# EasyEDA Pro project ProPrj_JS203-39-FIBER-3_2024-11-07.epro, board PCB1
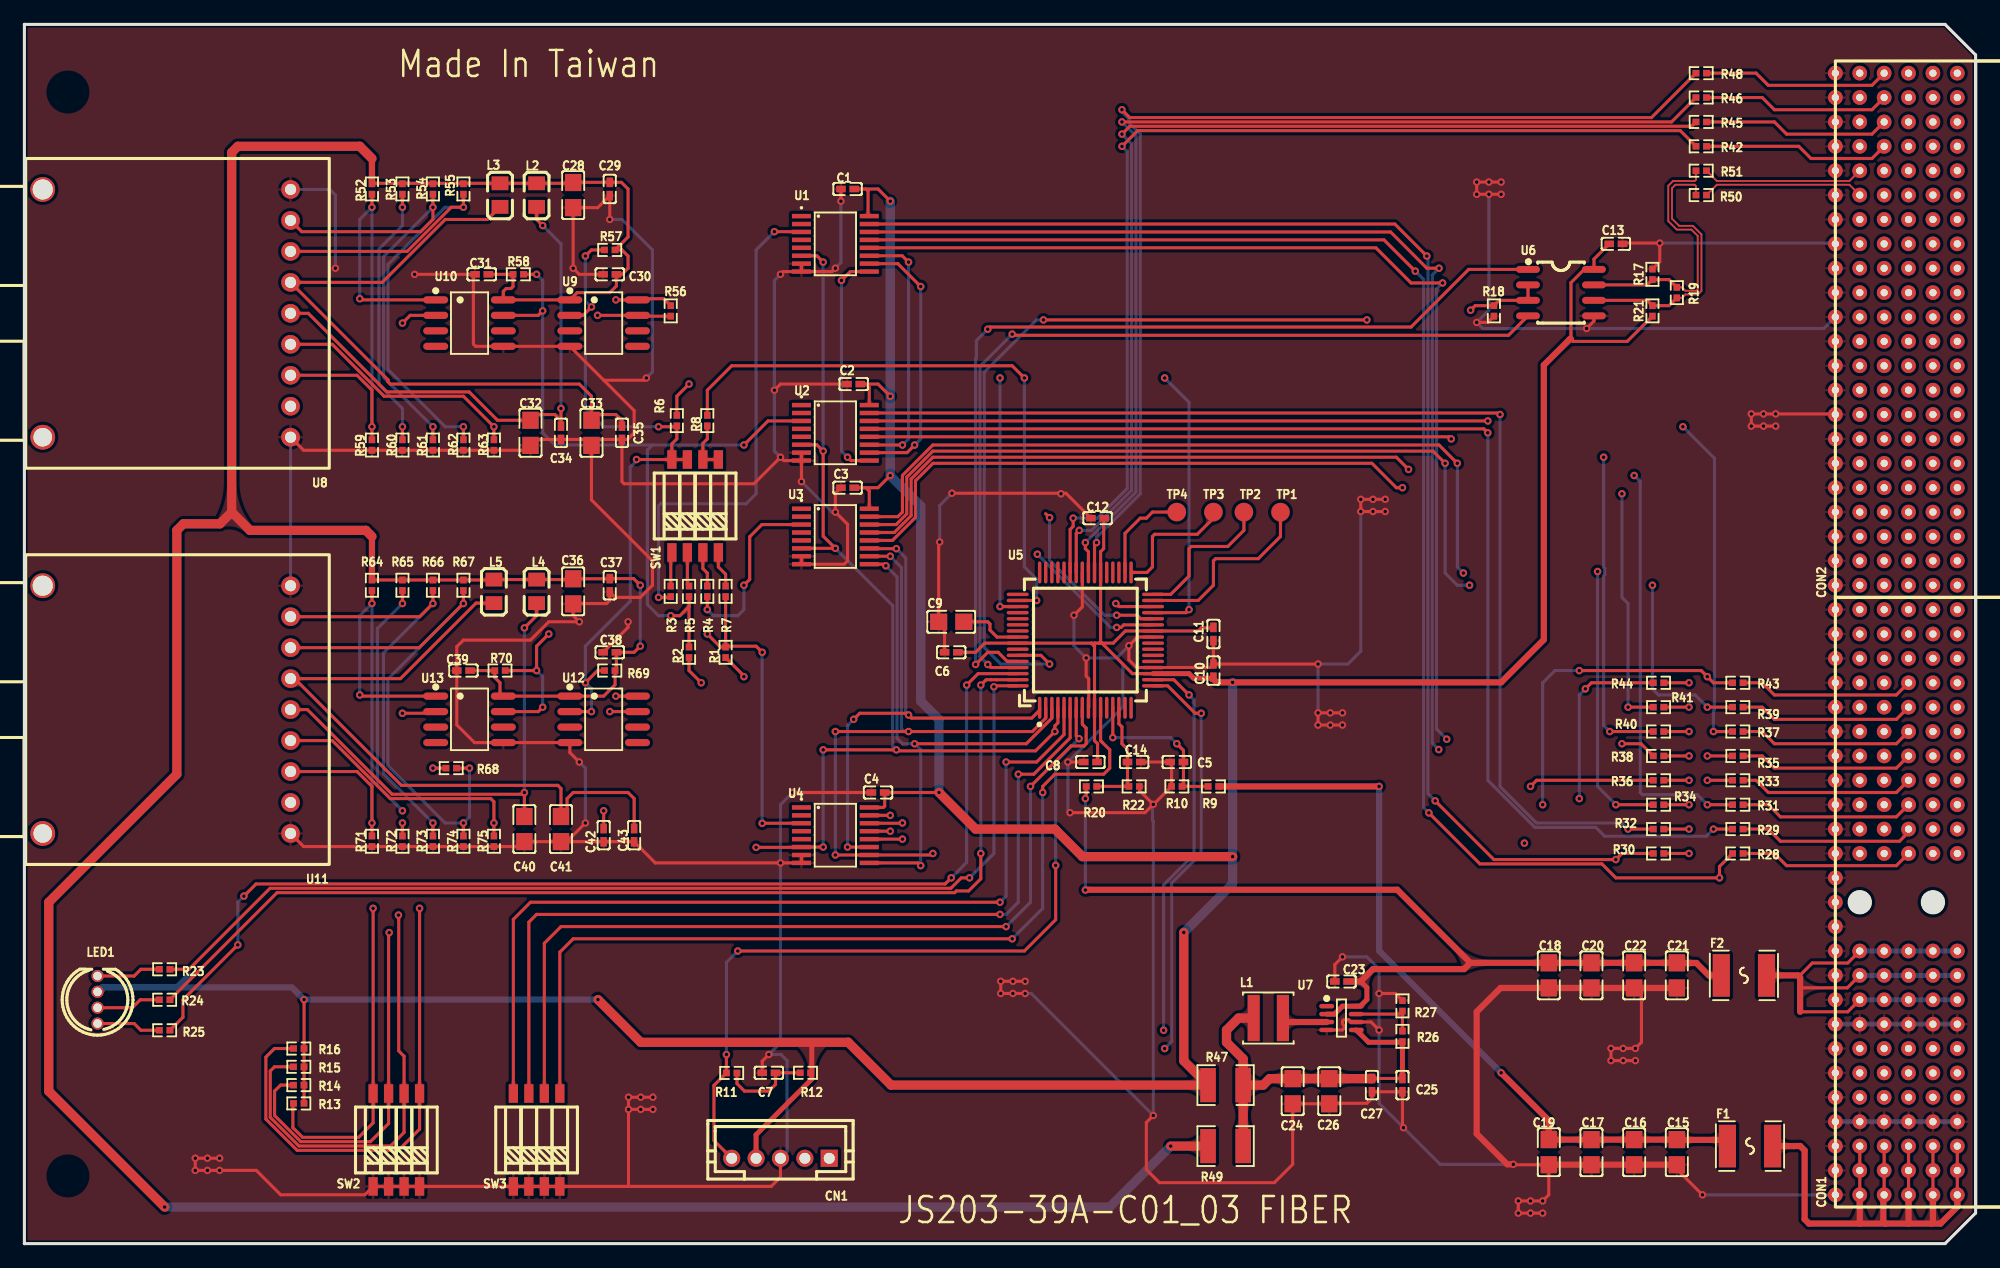
[diagram p4: board, top side]
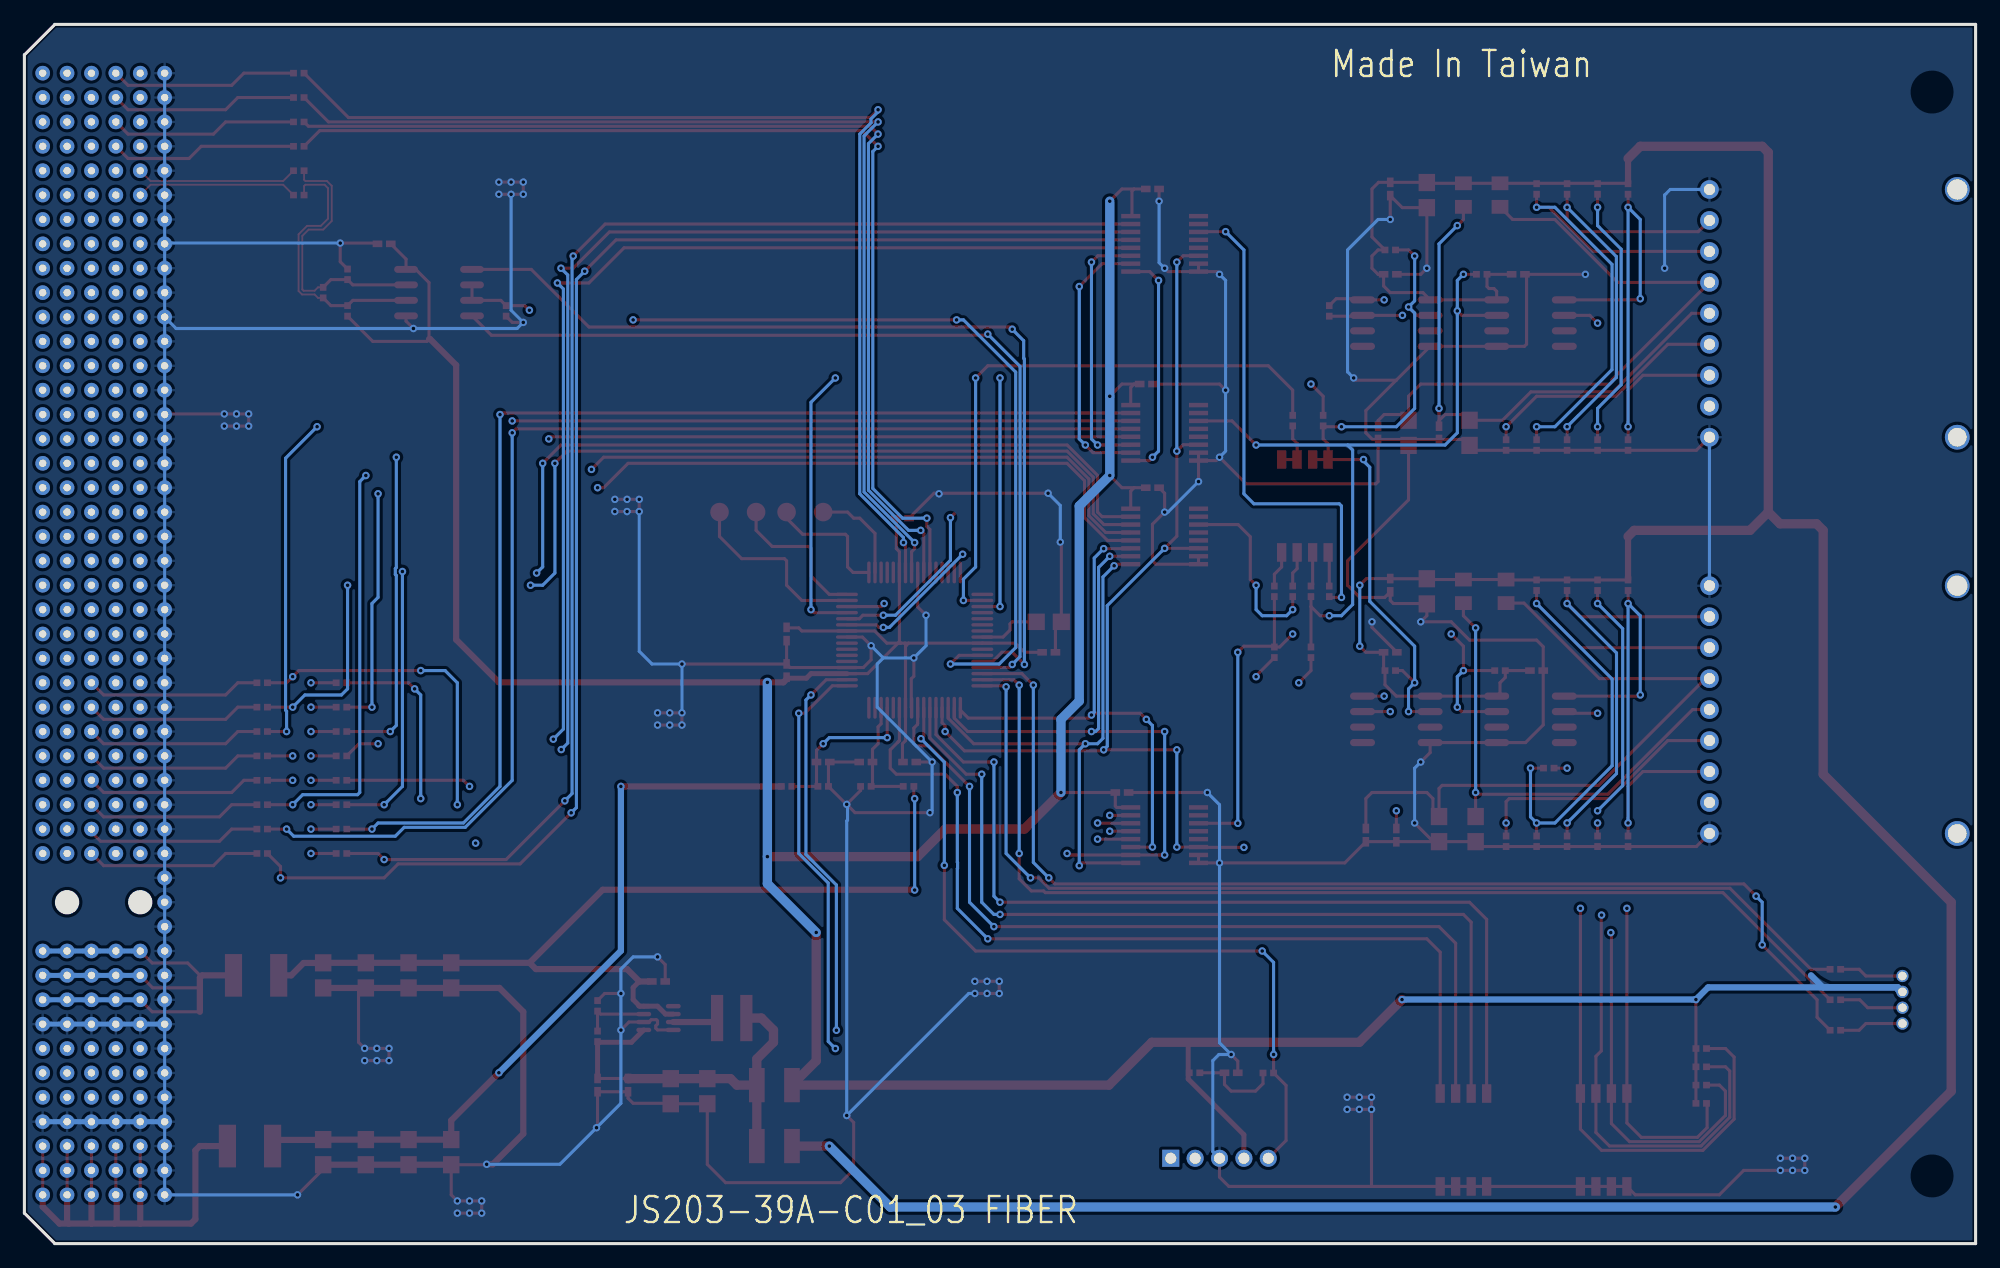
[diagram p5: board, bottom side, seen from below]

Outline 160 x 100 mm; copper layers: Top Layer, Inner1, Inner2, Bottom Layer. Coordinates in mm from the lower left corner of the outline.
Outline path: 0,100 0,0 157.5,0 160,2.5 160,97.5 157.5,100 0,100
Stack: Top Layer 0.035mm 外层铜厚1oz / Dielectric1 0.2104mm 7628 RC49% 8.6mil / Inner1 0.0152mm 内层铜厚 / Dielectric2 1.065mm 1.1mm H/HOZ Copper / Inner2 0.0152mm 内层铜厚 / Dielectric3 0.2104mm 7628 RC49% 8.6mil / Bottom Layer 0.035mm 外层铜厚1oz

## Design rules (mm)
net RS485_BUS_P: DP1
net RS485_BUS_N: DP1
net RS485_S0_P: DP2
net RS485_S0_N: DP2
template: JLCPCB Capability(Two Layers Board)
spacing copperThickness1oz (default): track to track 0.102, other pairs 0.152 to 0.3
spacing copperThickness2oz: track to track 0.203, other pairs 0.152 to 0.3
track width copperThickness1oz (default): min 0.127, default 0.254, max 2.54
track width copperThickness2oz: min 0.203, default 0.254, max 2.54
differential pair differentialPair (default): width min 0.127, default 0.254, max 2.54; gap min 0.152, default 0.152
via viaSize (default): diameter min 0.5, default 0.61, max 10; hole min 0.3, default 0.305, max 6.3

## Placement (name value [footprint] x y rotation side)
C1  104  [C0402]  67.5 86.5 0 top
C2  104  [C0402]  68 70.5 0 top
C3  104  [C0402]  67.5 62 0 top
C4  104  [C0402]  70 37 0 top
C5  104  [C0402]  94.5 39.5 180 top
C6  104  [C0402]  76 48.5 180 top
C7  104  [C0402]  61.05 14.01 180 top
C8  104  [C0402]  87.41 39.5 180 top
C9  10uF/10V  [C0805]  76 51 0 top
C10  104  [C0402]  97.5 47 90 top
C11  104  [C0402]  97.5 50 270 top
C12  104  [C0402]  88 59.5 180 top
C13  104  [C0402]  130.5 82 0 top
C14  104  [C0402]  91 39.5 0 top
C15  10uF/25V  [C0805]  135.5 7.5 270 top
C16  10uF/25V  [C0805]  132 7.5 270 top
C17  10uF/25V  [C0805]  128.5 7.5 270 top
C18  47uF/10V  [C0805]  125 22 270 top
C19  10uF/25V  [C0805]  125 7.5 270 top
C20  47uF/10V  [C0805]  128.5 22 270 top
C21  47uF/10V  [C0805]  135.5 22 270 top
C22  47uF/10V  [C0805]  132 22 270 top
C23  104  [C0402]  108 21.5 0 top
C24  47uF/10V  [C0805]  104 12.5 90 top
C25  15p  [C0402]  113 13 90 top
C26  47uF/10V  [C0805]  107 12.5 90 top
C27  104  [C0402]  110.5 13 90 top
C28  4.7uF  [C0805]  45 86 270 top
C29  104  [C0402]  48 86.5 270 top
C30  104  [C0402]  48 79.5 180 top
C31  104  [C0402]  37.5 79.5 180 top
C32  4.7uF  [C0805]  41.5 66.5 270 top
C33  4.7uF  [C0805]  46.5 66.5 270 top
C34  104  [C0402]  44 66.5 270 top
C35  104  [C0402]  49 66.5 270 top
C36  4.7uF  [C0805]  45 53.5 270 top
C37  104  [C0402]  48 54 270 top
C38  104  [C0402]  48 48.5 180 top
C39  104  [C0402]  36 47 180 top
C40  4.7uF  [C0805]  41 34 270 top
C41  4.7uF  [C0805]  44 34 270 top
C42  104  [C0402]  47.5 33.5 270 top
C43  104  [C0402]  50 33.5 270 top
CN1  5PIN-2.0MM-90  [CONN-TH_5P-P2.00-PH5A]  62 7 180 top
CON1  CPCI-CON-B  [cpci-con-b]  148.5 46 90 top
CON2  CPCI-CON-A  [cpci-con-a]  148.5 96 90 top
F1  FUSE_F1812_2A  [F1812]  141.5 8 0 top
F2  FUSE_F1812_2A  [F1812]  141 22 0 top
L1  1uH  [IND-SMD_L4.0-W4.0-A]  102 18.5 180 top
L2  1uH  [L0805]  42 86 90 top
L3  1uH  [L0805]  39 86 90 top
L4  1uH  [L0805]  42 53.5 90 top
L5  1uH  [L0805]  38.5 53.5 90 top
LED1  LED_RGB_5MM  [LED-TH_4P-BD5.8-P1.30]  6 20 90 top
R1  1K  [R0402]  57.5 48.5 270 top
R2  1K  [R0402]  54.5 48.5 270 top
R3  100R  [R0402]  53 53.5 90 top
R4  100R  [R0402]  56 53.5 90 top
R5  100R  [R0402]  54.5 53.5 90 top
R6  1K  [R0402]  53.5 67.5 90 top
R7  100R  [R0402]  57.5 53.5 90 top
R8  1K  [R0402]  56 67.5 90 top
R9  10K  [R0402]  97.5 37.5 0 top
R10  2K  [R0402]  94.5 37.5 0 top
R11  1K  [R0402]  58 14 180 top
R12  10K  [R0402]  64.05 14.01 180 top
R13  10K  [R0402]  22.5 11.5 0 top
R14  10K  [R0402]  22.5 13 0 top
R15  10K  [R0402]  22.5 14.5 0 top
R16  10K  [R0402]  22.5 16 0 top
R17  10K  [R0402]  133.5 79.5 90 top
R18  10K  [R0402]  120.5 76.5 270 top
R19  1K  [R0402]  135.5 78 270 top
R20  10K  [R0402]  87.5 37.5 180 top
R21  10K  [R0402]  133.5 76.5 90 top
R22  2K  [R0402]  91 37.5 180 top
R23  1K  [R0402]  11.5 22.5 0 top
R24  1K  [R0402]  11.5 20 0 top
R25  1K  [R0402]  11.5 17.5 0 top
R26  45K  [R0402]  113 17 90 top
R27  10K  [R0402]  113 19.5 90 top
R28  33R  [R0402]  140.5 32 0 top
R29  33R  [R0402]  140.5 34 0 top
R30  33R  [R0402]  134 32 180 top
R31  33R  [R0402]  140.5 36 0 top
R32  33R  [R0402]  134 34 180 top
R33  33R  [R0402]  140.5 38 0 top
R34  33R  [R0402]  134 36 180 top
R35  33R  [R0402]  140.5 40 0 top
R36  33R  [R0402]  134 38 180 top
R37  33R  [R0402]  140.5 42 0 top
R38  33R  [R0402]  134 40 180 top
R39  33R  [R0402]  140.5 44 0 top
R40  33R  [R0402]  134 42 180 top
R41  33R  [R0402]  134 44 180 top
R42  33R  [R0402]  137.5 90 180 top
R43  33R  [R0402]  140.5 46 0 top
R44  33R  [R0402]  134 46 180 top
R45  33R  [R0402]  137.5 92 180 top
R46  33R  [R0402]  137.5 94 180 top
R47  0R  [R1210]  98.5 13 180 top
R48  33R  [R0402]  137.5 96 180 top
R49  0R  [R1210]  98.5 8 180 top
R50  33R  [R0402]  137.5 86 0 top
R51  33R  [R0402]  137.5 88 0 top
R52  127R  [R0402]  28.5 86.5 90 top
R53  127R  [R0402]  31 86.5 90 top
R54  127R  [R0402]  33.5 86.5 90 top
R55  127R  [R0402]  36 86.5 90 top
R56  100R  [R0402]  53 76.5 90 top
R57  1K  [R0402]  48 81.5 0 top
R58  1K  [R0402]  40.5 79.5 0 top
R59  82R  [R0402]  28.5 65.5 90 top
R60  82R  [R0402]  31 65.5 90 top
R61  82R  [R0402]  33.5 65.5 90 top
R62  82R  [R0402]  36 65.5 90 top
R63  10K  [R0402]  38.5 65.5 90 top
R64  127R  [R0402]  28.5 54 90 top
R65  127R  [R0402]  31 54 90 top
R66  127R  [R0402]  33.5 54 90 top
R67  127R  [R0402]  36 54 90 top
R68  100R  [R0402]  35 39 0 top
R69  1K  [R0402]  48 47 0 top
R70  1K  [R0402]  39 47 0 top
R71  82R  [R0402]  28.5 33 90 top
R72  82R  [R0402]  31 33 90 top
R73  82R  [R0402]  33.5 33 90 top
R74  82R  [R0402]  36 33 90 top
R75  10K  [R0402]  38.5 33 90 top
SW1  SMD DIPSWx4  [SW-SMD_8P-L6.7-W5.4-P1.27-LS8.4]  55 60.5 0 top
SW2  SMD DIPSWx4  [SW-SMD_8P-L6.7-W5.4-P1.27-LS8.4]  30.5 8.5 0 top
SW3  SMD DIPSWx4  [SW-SMD_8P-L6.7-W5.4-P1.27-LS8.4]  42 8.5 0 top
TP1  -  [testPoint]  103 60 270 top
TP2  -  [testPoint]  100 60 270 top
TP3  -  [testPoint]  97.5 60 270 top
TP4  -  [testPoint]  94.5 60 270 top
U1  74HC4051  [TSSOP-16_L5.0-W4.4-P0.65-LS6.4-BL-1]  66.5 82 270 top
U2  74HC4051  [TSSOP-16_L5.0-W4.4-P0.65-LS6.4-BL-1]  66.5 66.5 270 top
U3  74HC4051  [TSSOP-16_L5.0-W4.4-P0.65-LS6.4-BL-1]  66.5 58 270 top
U4  74HC4051  [TSSOP-16_L5.0-W4.4-P0.65-LS6.4-BL-1]  66.5 33.5 270 top
U5  PIC24EP128GP206-I/PT  [TQFP-64_L10.0-W10.0-P0.50-LS12.0-BL]  87 49.5 0 top
U6  MAX485  [SOIC-8_L5.0-W4.0-P1.27-LS6.0-BL]  126 78 270 top
U7  MP2143DJ-LF-Z  [TSOT-23-8_L2.9-W1.6-P0.65-LS2.8-BR]  108 18.5 180 top
U8  -  [AFBR-5803TZ]  25 89 180 top
U9  MAX9110ESA+T  [SOIC-8_L4.9-W3.9-P1.27-LS6.0-BL]  47.5 75.5 270 top
U10  MAX9111ESA+T  [SOIC-8_L4.9-W3.9-P1.27-LS6.0-BL]  36.5 75.5 270 top
U11  -  [AFBR-5803TZ]  25 56.5 180 top
U12  MAX9110ESA+T  [SOIC-8_L4.9-W3.9-P1.27-LS6.0-BL]  47.5 43 270 top
U13  MAX9111ESA+T  [SOIC-8_L4.9-W3.9-P1.27-LS6.0-BL]  36.5 43 270 top

## Footprints (pads in the part's own frame, mm; a bottom-side part is the same pattern mirrored in y, then rotated)
AFBR-5803TZ
  round 1.524 hole 0.914: 1(3.175,22.86) 2(3.175,20.32) 3(3.175,17.78) 4(3.175,15.24) 5(3.175,12.7) 6(3.175,10.16) 7(3.175,7.62) 8(3.175,5.08) 9(3.175,2.54)
  round 2.032 hole 1.651x1.524: 10(23.495,2.54)
  round 2.032 hole 1.524: 11(23.495,22.86)
C0402
  rect 0.79x0.54 smd: 1(-0.545,0) 2(0.545,0)
C0805
  rect 1.41x1.35 smd: 1(-1.03,0) 2(1.03,0)
CONN-TH_5P-P2.00-PH5A
  rect 1.4x1.4 hole 0.9: 1(-4,0)
  round 1.4 hole 0.9: 2(-2,0) 3(0,0) 4(2,0) 5(4,0)
cpci-con-a
  round 1.2 hole 0.6: A1(-42,-10) A2(-40,-10) A3(-38,-10) A4(-36,-10) A5(-34,-10) A6(-32,-10) A7(-30,-10) A8(-28,-10) A9(-26,-10) A10(-24,-10) A11(-22,-10) A12(-20,-10) A13(-18,-10) A14(-16,-10) A15(-14,-10) A16(-12,-10) A17(-10,-10) A18(-8,-10) A19(-6,-10) A20(-4,-10) A21(-2,-10) A22(0,-10) B1(-42,-8) B2(-40,-8) B3(-38,-8) B4(-36,-8) B5(-34,-8) B6(-32,-8) B7(-30,-8) B8(-28,-8) B9(-26,-8) B10(-24,-8) B11(-22,-8) B12(-20,-8) B13(-18,-8) B14(-16,-8) B15(-14,-8) B16(-12,-8) B17(-10,-8) B18(-8,-8) B19(-6,-8) B20(-4,-8) B21(-2,-8) B22(0,-8) C1(-42,-6) C2(-40,-6) C3(-38,-6) C4(-36,-6) C5(-34,-6) C6(-32,-6) C7(-30,-6) C8(-28,-6) C9(-26,-6) C10(-24,-6) C11(-22,-6) C12(-20,-6) C13(-18,-6) C14(-16,-6) C15(-14,-6) C16(-12,-6) C17(-10,-6) C18(-8,-6) C19(-6,-6) C20(-4,-6) C21(-2,-6) C22(0,-6) D1(-42,-4) D2(-40,-4) D3(-38,-4) D4(-36,-4) D5(-34,-4) D6(-32,-4) D7(-30,-4) D8(-28,-4) D9(-26,-4) D10(-24,-4) D11(-22,-4) D12(-20,-4) D13(-18,-4) D14(-16,-4) D15(-14,-4) D16(-12,-4) D17(-10,-4) D18(-8,-4) D19(-6,-4) D20(-4,-4) D21(-2,-4) D22(0,-4) E1(-42,-2) E2(-40,-2) E3(-38,-2) E4(-36,-2) E5(-34,-2) E6(-32,-2) E7(-30,-2) E8(-28,-2) E9(-26,-2) E10(-24,-2) E11(-22,-2) E12(-20,-2) E13(-18,-2) E14(-16,-2) E15(-14,-2) E16(-12,-2) E17(-10,-2) E18(-8,-2) E19(-6,-2) E20(-4,-2) E21(-2,-2) E22(0,-2) F1(-42,0) F2(-40,0) F3(-38,0) F4(-36,0) F5(-34,0) F6(-32,0) F7(-30,0) F8(-28,0) F9(-26,0) F10(-24,0) F11(-22,0) F12(-20,0) F13(-18,0) F14(-16,0) F15(-14,0) F16(-12,0) F17(-10,0) F18(-8,0) F19(-6,0) F20(-4,0) F21(-2,0) F22(0,0)
cpci-con-b
  round 1.2 hole 0.6: A1(-42,-10) A2(-40,-10) A3(-38,-10) A4(-36,-10) A5(-34,-10) A6(-32,-10) A7(-30,-10) A8(-28,-10) A9(-26,-10) A10(-24,-10) A11(-22,-10) A15(-14,-10) A16(-12,-10) A17(-10,-10) A18(-8,-10) A19(-6,-10) A20(-4,-10) A21(-2,-10) A22(0,-10) A23(2,-10) A24(4,-10) A25(6,-10) B1(-42,-8) B2(-40,-8) B3(-38,-8) B4(-36,-8) B5(-34,-8) B6(-32,-8) B7(-30,-8) B8(-28,-8) B9(-26,-8) B10(-24,-8) B11(-22,-8) B15(-14,-8) B16(-12,-8) B17(-10,-8) B18(-8,-8) B19(-6,-8) B20(-4,-8) B21(-2,-8) B22(0,-8) B23(2,-8) B24(4,-8) B25(6,-8) C1(-42,-6) C2(-40,-6) C3(-38,-6) C4(-36,-6) C5(-34,-6) C6(-32,-6) C7(-30,-6) C8(-28,-6) C9(-26,-6) C10(-24,-6) C11(-22,-6) C15(-14,-6) C16(-12,-6) C17(-10,-6) C18(-8,-6) C19(-6,-6) C20(-4,-6) C21(-2,-6) C22(0,-6) C23(2,-6) C24(4,-6) C25(6,-6) D1(-42,-4) D2(-40,-4) D3(-38,-4) D4(-36,-4) D5(-34,-4) D6(-32,-4) D7(-30,-4) D8(-28,-4) D9(-26,-4) D10(-24,-4) D11(-22,-4) D15(-14,-4) D16(-12,-4) D17(-10,-4) D18(-8,-4) D19(-6,-4) D20(-4,-4) D21(-2,-4) D22(0,-4) D23(2,-4) D24(4,-4) D25(6,-4) E1(-42,-2) E2(-40,-2) E3(-38,-2) E4(-36,-2) E5(-34,-2) E6(-32,-2) E7(-30,-2) E8(-28,-2) E9(-26,-2) E10(-24,-2) E11(-22,-2) E15(-14,-2) E16(-12,-2) E17(-10,-2) E18(-8,-2) E19(-6,-2) E20(-4,-2) E21(-2,-2) E22(0,-2) E23(2,-2) E24(4,-2) E25(6,-2) F1(-42,0) F2(-40,0) F3(-38,0) F4(-36,0) F5(-34,0) F6(-32,0) F7(-30,0) F8(-28,0) F9(-26,0) F10(-24,0) F11(-22,0) F12(-20,0) F13(-18,0) F14(-16,0) F15(-14,0) F16(-12,0) F17(-10,0) F18(-8,0) F19(-6,0) F20(-4,0) F21(-2,0) F22(0,0) F23(2,0) F24(4,0) F25(6,0)
F1812
  rect 1.407x3.499 smd: 1(-1.853,0) 2(1.853,0)
IND-SMD_L4.0-W4.0-A
  rect 1x3.8 smd: 1(-1.2,0) 2(1.2,0)
L0805
  rect 1.133x1.377 smd: 1(-0.966,0) 2(0.966,0)
LED-TH_4P-BD5.8-P1.30
  round 1 hole 0.7: 1(1.95,0) 2(0.65,0) 3(-0.65,0) 4(-1.95,0)
R0402
  rect 0.566x0.54 smd: 1(-0.433,0) 2(0.433,0)
R1210
  rect 1.282x2.808 smd: 1(-1.441,0) 2(1.441,0)
SOIC-8_L4.9-W3.9-P1.27-LS6.0-BL
  oval 0.588x2.045 smd: 1(-1.905,-2.772) 2(-0.635,-2.772) 3(0.635,-2.772) 4(1.905,-2.772) 5(1.905,2.772) 6(0.635,2.772) 7(-0.635,2.772) 8(-1.905,2.772)
SOIC-8_L5.0-W4.0-P1.27-LS6.0-BL
  oval 0.569x1.95 smd: 1(-1.905,-2.705) 2(-0.635,-2.705) 3(0.635,-2.705) 4(1.905,-2.705) 5(1.905,2.705) 6(0.635,2.705) 7(-0.635,2.705) 8(-1.905,2.705)
SW-SMD_8P-L6.7-W5.4-P1.27-LS8.4
  rect 0.762x1.524 smd: 1(-1.905,-3.81) 2(-0.635,-3.81) 3(0.635,-3.81) 4(1.905,-3.81) 5(1.905,3.81) 6(0.635,3.81) 7(-0.635,3.81) 8(-1.905,3.81)
testPoint
  round 1.524 smd: 1(0,0)
TQFP-64_L10.0-W10.0-P0.50-LS12.0-BL
  oval 0.28x1.8 smd: 1(-3.75,-5.55) 2(-3.25,-5.55) 3(-2.75,-5.55) 4(-2.25,-5.55) 5(-1.75,-5.55) 6(-1.25,-5.55) 7(-0.75,-5.55) 8(-0.25,-5.55) 9(0.25,-5.55) 10(0.75,-5.55) 11(1.25,-5.55) 12(1.75,-5.55) 13(2.25,-5.55) 14(2.75,-5.55) 15(3.25,-5.55) 16(3.75,-5.55) 33(3.75,5.55) 34(3.25,5.55) 35(2.75,5.55) 36(2.25,5.55) 37(1.75,5.55) 38(1.25,5.55) 39(0.75,5.55) 40(0.25,5.55) 41(-0.25,5.55) 42(-0.75,5.55) 43(-1.25,5.55) 44(-1.75,5.55) 45(-2.25,5.55) 46(-2.75,5.55) 47(-3.25,5.55) 48(-3.75,5.55)
  oval 1.8x0.28 smd: 17(5.55,-3.75) 18(5.55,-3.25) 19(5.55,-2.75) 20(5.55,-2.25) 21(5.55,-1.75) 22(5.55,-1.25) 23(5.55,-0.75) 24(5.55,-0.25) 25(5.55,0.25) 26(5.55,0.75) 27(5.55,1.25) 28(5.55,1.75) 29(5.55,2.25) 30(5.55,2.75) 31(5.55,3.25) 32(5.55,3.75) 49(-5.55,3.75) 50(-5.55,3.25) 51(-5.55,2.75) 52(-5.55,2.25) 53(-5.55,1.75) 54(-5.55,1.25) 55(-5.55,0.75) 56(-5.55,0.25) 57(-5.55,-0.25) 58(-5.55,-0.75) 59(-5.55,-1.25) 60(-5.55,-1.75) 61(-5.55,-2.25) 62(-5.55,-2.75) 63(-5.55,-3.25) 64(-5.55,-3.75)
TSOT-23-8_L2.9-W1.6-P0.65-LS2.8-BR
  oval 1.222x0.364 smd: 1(1.211,-0.975) 2(1.211,-0.325) 3(1.211,0.325) 4(1.211,0.975) 5(-1.211,0.975) 6(-1.211,0.325) 7(-1.211,-0.325) 8(-1.211,-0.975)
TSSOP-16_L5.0-W4.4-P0.65-LS6.4-BL-1
  rect 0.364x1.56 smd: 1(-2.275,-2.78) 2(-1.625,-2.78) 3(-0.975,-2.78) 4(-0.325,-2.78) 5(0.325,-2.78) 6(0.975,-2.78) 7(1.625,-2.78) 8(2.275,-2.78) 9(2.275,2.78) 10(1.625,2.78) 11(0.975,2.78) 12(0.325,2.78) 13(-0.325,2.78) 14(-0.975,2.78) 15(-1.625,2.78) 16(-2.275,2.78)

## Nets
As in the schematic.

Pads without a net: CON1 A5 A6 A7 A15 A16 A17 A18 A19 A20 A21 A22 A23 A24 A25 B5 B6 B7 B15 B16 B17 B18 B19 B20 B21 B22 B23 B24 B25 C5 C6 C7 C23 C24 C25 D5 D6 D7 D23 D24 D25 E5 E6 E7 E15 E16 E17 E18 E19 E20 E21 E22 E23 E24 E25; CON2 A1 A2 A3 A4 A5 A6 A7 A8 A9 A10 A11 A12 A13 A14 A15 A16 A17 A18 A19 A20 A21 A22 B1 B2 B3 B4 B5 B6 B7 B8 B9 B10 B11 B12 B13 B14 B15 B16 B17 B18 B19 B20 B21 B22 C1 C2 C3 C4 C5 C6 C7 C8 C9 C10 C11 C12 C13 C14 C15 C16 C17 C18 C19 C20 C21 C22 D1 D2 D3 D4 D5 D6 D7 D8 D9 D10 D11 D12 D13 D14 D15 D16 D17 D18 E1 E2 E3 E4 E5 E6 E7 E8 E9 E10 E11 E12 E13 E14 E15 E16 E19 E20 E21 E22; U1 1 2 4 5; U2 1 2 4 5; U3 1 2 4 5; U4 1 2 4 5; U5 12 15 16 21 22 23 24 27 28 35 36 37 44 45 46 47 48 49 52 53 54 55 58; U7 1; U8 10 11; U9 3 5 6; U10 3 4 6; U11 10 11; U12 3 5 6; U13 3 4 6

## Via types
v1: diameter 0.61, hole 0.305, Top Layer to Bottom Layer, 306 vias

## Routing (per net, layer and track width the routed paths; a pad name or vN(x,y) marks a point on that pad's centre or on a via; arc(x,y) is an arc through that point)
GND: length 935.5
  Top Layer w0.254: U2.7 U2.8 ; U2.8 v1(63.72,62.5) ; U2.8 62.28,64.22 v1(62,64.5) 59.82,62.32 49.18,62.32 49,62.5 C35.2 ; C33.2 46.98,65.95 C35.2 ; C33.2 46.5,61 51.5,56 51.5,54 50.5,53 48.45,53 C37.2 48,52.75 47.75,52.5 45.03,52.5 C36.2 45,51.5 v1(45.5,51) 43,51 41.5,49.5 36,49.5 35.45,48.95 C39.2 35.45,42.55 36.91,41.09 U13.5 U12.4 44.73,40.27 v1(45.5,39.5) ; C33.2 46.02,65.95 C34.2 41.98,65.95 C32.2 41.1,65.07 R63.1 R62.1 R61.1 R60.1 R59.1 22.9,65.07 U8.1 ; v1(49.54,11.01) v1(50.54,11.01) v1(51.54,11.01) ; v1(49.54,11.01) v1(49.54,12.01) v1(50.54,12.01) v1(51.54,12.01) ; v1(49.54,11.01) 49.54,4.74 49.59,4.69 ; C6.2 75.46,50.52 C9.1 74.97,57.46 v1(75.06,57.54) ; U11.1 22.9,32.57 R71.1 R72.1 R73.1 R74.1 R75.1 40.6,32.57 C40.2 C41.2 44.47,32.97 ; v1(63,37) C4.1 ; v1(66.5,80) 66.22,79.72 U1.8 ; C11.2 C10.2 ; C10.2 97.51,47.54 v1(106.08,47.54) ; C10.2 97.21,47.25 U5.20 91.21,47.25 90.57,47.89 v1(90.57,49.04) 91.28,49.75 U5.25 ; v1(111.58,60.05) v1(110.58,60.05) v1(109.58,60.05) v1(109.58,61.05) v1(110.58,61.05) v1(111.58,61.05) ; v1(85.74,35.35) 91.89,35.35 v1(92.57,36.03) ; C14.2 C5.2 94.07,39.39 R10.1 92.59,36.03 v1(92.57,36.03) ; v1(92.57,10.51) 92,9.94 92,6.07 93.07,5 102.5,5 104,6.5 C24.1 C26.1 107.04,11.51 110.08,11.51 110.5,11.93 C27.1 C25.1 113,9.59 v1(113.09,9.51) ; v1(86.07,51.54) 86.75,52.22 U5.41 ; v1(122.09,6.5) 122.13,6.47 C19.2 125,4 124.5,3.5 v1(124.5,3.5) v1(123.5,3.5) v1(122.5,3.5) v1(122.5,2.5) v1(123.5,2.5) v1(124.5,2.5) ; 132.36,20.97 132.6,20.73 132.6,16.51 132.1,16.01 v1(132.1,16.01) v1(131.1,16.01) v1(130.1,16.01) v1(130.1,15.01) v1(131.1,15.01) v1(132.1,15.01) ; U1.7 U1.8 ; U1.8 62.22,79.72 v1(62,79.5) ; v1(76.06,61.55) 85.41,61.55 C12.2 ; R27.2 112.42,20.52 v1(111.08,20.52) ; v1(121.09,86.07) v1(120.09,86.07) v1(119.09,86.07) v1(119.09,87.07) v1(120.09,87.07) v1(121.09,87.07) ; 47.5,70.82 U9.4 U10.5 37,73.59 36.82,73.77 36.82,79.37 C31.2 v1(32,79.5) ; 47.5,70.82 50,68.32 50,66.5 49.45,65.95 C35.2 ; 47.5,70.82 50.82,70.82 v1(51,71) ; 49.59,4.69 SW3.4 SW3.3 SW3.2 SW3.1 SW2.4 SW2.3 SW2.2 SW2.1 27.91,4 21.02,4 19.01,6 v1(16.01,6) v1(15.01,6) v1(14.01,6) v1(14.01,7) v1(15.01,7) v1(16.01,7) ; 49.59,4.69 61.23,4.69 62,5.46 CN1.3 ; v1(108.08,43.53) v1(107.08,43.53) v1(106.08,43.53) v1(106.08,42.53) v1(107.08,42.53) v1(108.08,42.53) ; C23.1 107.46,22.89 v1(108.08,23.52) ; U5.9 87.27,43.97 87.27,46.33 87.07,46.54 v1(87.07,48.04) ; v1(49.5,51) 49.5,50.55 C38.2 ; C13.2 131.11,82.06 v1(134.1,82.06) 134.1,80.53 R17.2 ; v1(111.08,17.51) 110.42,18.18 U7.6 108.79,18.18 108.6,18.36 108.18,18.36 108.08,18.27 108.08,18.01 108.22,17.87 108.22,17.67 108.08,17.53 U7.4 ; v1(92.57,36.03) 91.43,37.17 R22.1 ; C3.1 66.5,61.55 v1(66.5,60) 67.5,59 67.5,56 67.22,55.72 U3.8 U3.7 ; C30.2 45.5,79.5 v1(45,80) C28.2 47.02,84.97 C29.2 v1(48,84) ; 44.47,32.97 v1(46,34.5) ; 44.47,32.97 49.98,32.97 C43.2 51.73,31.22 v1(62,31.22) U4.8 U4.7 ; v1(143.61,67.05) v1(142.61,67.05) v1(141.61,67.05) v1(141.61,68.05) v1(142.61,68.05) v1(143.61,68.05) 148.45,68.05 CON2.F8 ; C7.2 60.5,14.97 v1(61.05,15.51) ; v1(137.6,4) 135.5,6.1 C15.2 ; C8.2 v1(85.56,39.5) ; v1(82.06,20.52) v1(81.06,20.52) v1(80.06,20.52) v1(80.06,21.52) v1(81.06,21.52) v1(82.06,21.52) ; v1(128.1,75.06) 128.71,75.67 U6.5 ; v1(119.09,75.56) 119.99,75.56 R18.2 ; v1(61.5,70) 62,70.5 C2.1 ; C1.1 v1(66.96,85.5)
  Top Layer w0.508: 132.36,20.97 C21.2 ; C19.2 C17.2 C16.2 C15.2 ; C22.2 C20.2 C18.2 121.05,20.97 119.09,19.01 119.09,9.01 121.59,6.5 v1(122.09,6.5)
  Inner1 w0.254: v1(25.5,80) 26,79.5 v1(32,79.5) ; v1(66.5,60) 67.5,61 75.51,61 v1(76.06,61.55) ; v1(49.5,51) v1(45.5,51)
  Inner2 w0.254: v1(86.07,51.54) 85,52.6 v1(85,61.5)
  Bottom Layer w0.254: v1(45.5,39.5) 46,39 v1(46,34.5) ; v1(66.96,85.5) 66.96,80.45 v1(66.5,80) ; U11.9 U8.1 ; v1(106.08,43.53) v1(106.08,47.54) 108.54,47.54 109.58,48.58 v1(109.58,60.05) ; v1(75.06,57.54) 75.06,60.55 v1(76.06,61.55) ; 89.57,48.04 v1(90.57,49.04) ; 89.57,48.04 90.07,47.54 90.07,44 v1(85.56,39.5) 85.56,35.53 v1(85.74,35.35) ; 89.57,48.04 v1(87.07,48.04) 86.07,49.04 v1(86.07,51.54) ; v1(48,84) 49,84 51.5,81.5 51.5,71.5 v1(51,71) ; CON2.F15 CON2.F16 CON2.F17 CON2.F18 CON2.F19 CON2.F20 CON2.F21 CON2.F22 ; CON2.F15 CON2.F14 CON2.F13 CON2.F12 ; CON2.F15 148.44,82.06 v1(134.1,82.06) ; v1(108.08,23.52) 110.08,23.52 111.08,22.52 v1(111.08,20.52) v1(111.08,17.51) 111.08,11.51 v1(113.09,9.51) 116.09,6.5 v1(122.09,6.5) ; v1(62,64.5) 61.5,65 v1(61.5,70) 61.5,79 v1(62,79.5) ; CON2.F12 147.56,75.06 v1(128.1,75.06) 119.59,75.06 v1(119.09,75.56) 120.09,76.56 v1(120.09,86.07) ; CON2.F12 CON2.F11 CON2.F10 CON2.F9 CON2.F8 CON2.F7 CON2.F6 CON2.F5 CON2.F4 CON2.F3 CON2.F2 CON2.F1 CON1.F25 CON1.F24 CON1.F23 CON1.F22 CON1.F21 CON1.F20 CON1.F19 CON1.F18 CON1.F17 CON1.F16 CON1.F15 CON1.F14 CON1.F13 CON1.F12 CON1.F11 CON1.F10 CON1.F9 CON1.F8 CON1.F7 CON1.F6 CON1.F5 CON1.F4 CON1.F3 CON1.F2 CON1.F1 v1(137.6,4) ; v1(63.72,62.5) 66.22,60 v1(66.5,60) ; v1(92.57,36.03) 92.5,35.96 92.5,34.74 92.57,34.67 v1(92.57,10.51) 82.56,20.52 v1(82.06,20.52) ; v1(25.5,80) 25.5,86 25.04,86.46 U8.9 ; v1(63,37) 62,36 v1(62,31.22) 62,16.47 v1(61.05,15.51) 62.05,15.51 62.55,15.01 62.55,7.55 CN1.3
  Bottom Layer w0.406: CON1.F4 CON1.E4 CON1.D4 CON1.C4 CON1.B4 CON1.A4 ; CON1.F8 CON1.E8 CON1.D8 CON1.C8 CON1.B8 CON1.A8
VCC: length 381
  Top Layer w0.254: 88.15,49.25 88.17,49.25 ; 88.15,49.25 88.17,49.27 ; 88.15,49.25 87.78,49.25 ; 88.17,49.25 88.35,49.25 ; 88.17,49.25 88.17,49.27 ; 88.35,49.25 89.28,49.25 90.28,50.25 U5.26 96.25,50.25 96.5,50.5 97.46,50.5 C11.1 ; 88.35,49.25 90.85,46.75 U5.19 ; 88.35,49.25 88.25,49.35 ; 69,86.5 70,86.5 v1(71,85.5) ; 69,86.5 C1.2 ; 69,86.5 69.18,86.32 69.18,84.38 U1.16 ; U2.16 69.28,70.22 69,70.5 ; 87.5,49.25 87.78,49.25 ; 87.5,49.25 U5.57 78.75,49.25 78,48.5 C6.1 ; 87.5,49.25 87.68,49.07 ; 87.78,49.25 87.78,49.17 87.68,49.07 ; C13.1 128.71,80.75 U6.8 127.91,79.91 126.82,78.82 126.82,74.18 127,74 131.43,74 R21.1 ; 88.17,49.27 88.25,49.35 ; v1(71,63) 70,62 69,62 ; 69,62 69.28,61.72 U3.16 ; 69,62 C3.2 ; U4.16 70.44,35.78 70.54,35.88 C4.2 v1(75,37) ; 87.68,49.07 87.75,49 U5.10 87.75,41.25 88,41 88,39.55 87.96,39.5 ; v1(71,69.5) 70,70.5 69,70.5 ; 69,70.5 C2.2 ; C12.1 88.5,59.45 88.5,57 88.25,56.75 U5.38 88.25,49.35 ; 97.42,46.38 C10.1 ; v1(22.93,20.01) R16.2 R15.2 R14.2 R13.2
  Top Layer w0.406: U5.19 95.5,46.75 95.88,46.38 97.42,46.38 ; CN1.4 60,8.93 64.57,13.5 64.57,16.42
  Top Layer w0.508: 126.82,74.18 126.72,74.18 124.59,72.05 124.59,49.54 121.09,46.03 v1(99.07,46.03) 97.76,46.03 97.42,46.38
  Top Layer w0.762: v1(95.07,25.52) 95.07,14.99 R47.2 71.06,13 67.55,16.51 50.54,16.51 v1(47.04,20.01) ; v1(99.07,31.74) 86.76,31.74 84.5,34 78,34 v1(75,37)
  Bottom Layer w0.254: 6.17,20.82 LED1.2
  Bottom Layer w0.508: 6.37,21.02 12.51,21.02 13.5,22.01 ; 6.37,21.02 6.37,20.82 6.17,20.82 ; 6.37,21.02 21.93,21.02 v1(22.93,20.01) v1(47.04,20.01)
  Bottom Layer w0.762: v1(99.07,46.03) v1(99.07,31.74) 99.07,29.52 v1(95.07,25.52) ; v1(75,37) 75,43 73.5,44.5 73.5,60.5 v1(71,63) v1(71,69.5) v1(71,85.5)
VCC_3P3: length 33.3
  Top Layer w0.254: C25.2 C27.2
  Top Layer w0.406: U7.5 110.22,16.51 112.95,16.51 R26.1 C25.2
  Top Layer w0.762: R47.1 99.94,15.15 98.57,16.51 98.57,17.51 99.56,18.5 L1.2 ; R47.1 R49.1 ; R47.1 101.58,13 102.11,13.53 C24.2 C26.2 110.49,13.53 C27.2
VCC_5V: length 79.7
  Top Layer w0.254: R20.2 87.07,36.57 v1(87,36.5)
  Top Layer w0.406: U7.2 107.43,18.82 108.08,19.47 U7.8 109.54,19.47 110.08,20.01 110.08,21 109.58,21.5 109.57,21.5 ; 108.82,21.5 C23.2
  Top Layer w0.508: F2.1 138.12,22 137.1,23.02 135.51,23.02 C21.1 C22.1 C20.1 C18.1 118.57,23.03 ; 108.82,21.5 109.57,21.5 110.58,22.52 118.06,22.52 118.57,23.03 ; 87.07,29.02 112.58,29.02 118.57,23.03
  Bottom Layer w0.254: v1(87,36.5) v1(87,29)
VCC_12V: length 62.8
  Top Layer w0.508: v1(121.09,14.01) 125,10.1 C19.1 C17.1 C16.1 C15.1 135.52,8.51 139.14,8.51 F1.1 ; R9.2 v1(111.08,37.5)
  Bottom Layer w0.508: v1(121.09,14.01) 111.08,24.02 v1(111.08,37.5)
VCCFB: length 307.3
  Top Layer w0.254: C28.1 45.02,87.05 C29.1 48.95,87.05 49.5,86.5 49.5,82.57 R57.2 49,81.5 49.5,81 49.5,80 49,79.5 C30.1 48.55,78.55 48,78 45.32,78 U9.1 U10.8 39.27,78.11 39.5,78.33 39.9,78.33 40.07,78.5 R58.1 C31.1 ; v1(50.5,49) 50,48.5 C38.1 48.55,47.11 R69.2 48.43,45.84 47.5,44.91 U12.1 U13.8 39,45.18 39,46 38.57,46.43 R70.1 C39.1 ; R64.2 R65.2 R66.2 R67.2 38.97,54.43 39,54.47 L4.2 44.94,54.47 C36.1 47.98,54.53 C37.1 49.95,54.55 v1(50.5,54) ; 44.5,87.03 44.5,86.97 L2.2 L3.2 28.53,86.97 R52.2
  Top Layer w0.508: 28.5,89 R52.2 ; R64.2 28.5,58
  Top Layer w0.762: v1(11.5,3) 2,12.5 2,28 12.5,38.5 12.5,58.5 13.04,59.04 16.04,59.04 17,60 ; 28.5,89 27.5,90 17.5,90 17,89.5 17,60 ; 17,60 18.5,58.5 28,58.5 28.5,58 ; R49.2 v1(94,8)
  Bottom Layer w0.254: v1(50.5,49) v1(50.5,54)
  Bottom Layer w0.762: v1(11.5,3) 89,3 v1(94,8)
(no net): length 26.5
  Top Layer w0.254: U5.27 90.14,50.75 89.93,50.54 v1(89.57,50.54) ; v1(89.57,51.54) 91.25,51.54 91.53,51.25 U5.28 ; v1(84.06,59.55) 83.74,59.87
  Bottom Layer w0.254: v1(89.57,51.54) 88.57,51.54 84.06,56.05 v1(84.06,59.55) ; v1(89.57,50.54) 89.07,50.54 v1(83.06,56.54)
  vias: v1(123,32.85)
ADI_5V: length 9.4
  Top Layer w0.254: U5.14 89.75,42.63 90,42.38 90,41 90.46,40.55 C14.1 90.46,37.61 R22.2 R20.1
ADI_12V: length 13.8
  Top Layer w0.254: v1(94.5,41) 95.04,40.45 C5.1 95.04,37.61 R10.2 R9.1 ; U5.13 v1(89.25,41.5)
  Bottom Layer w0.254: v1(94.5,41) 94,41.5 v1(89.25,41.5)
ASW_EN: length 154.3
  Top Layer w0.254: R16.1 20.5,16 19.8,15.3 19.8,10.21 22.37,7.65 30.67,7.65 32.41,9.39 SW2.5 v1(32.41,27.5) ; U2.6 64.97,65.53 v1(65.5,65) 65.5,58.03 v1(66.5,57.03) U3.6 ; v1(60,32.5) 63.69,32.5 U4.6 v1(65.5,32.53) ; U5.4 84.75,42.72 84.5,42.47 v1(84.5,42) 82.92,40.42 71.58,40.42 v1(71.5,40.5) v1(65.5,40.5) ; v1(65.5,80.5) 64.97,81.03 U1.6
  Inner1 w0.254: v1(60,32.5) 55,27.5 v1(32.41,27.5)
  Bottom Layer w0.254: v1(71.5,40.5) 71.2,40.8 71.2,52.32 v1(66.5,57.03) ; v1(65.5,80.5) v1(65.5,65) ; v1(65.5,32.53) v1(65.5,40.5)
ASW_S0: length 143.7
  Top Layer w0.254: v1(72.5,80.5) 71.97,81.03 U1.11 ; U3.11 69.31,57 v1(71.5,57) ; v1(72,65.5) 69.31,65.5 U2.11 ; v1(28.59,27.5) SW2.8 28.59,9.9 27.41,8.72 22.81,8.72 22.02,9.51 22.02,11.45 R13.1 ; U4.11 v1(67.5,32.53) ; U5.1 83.25,43.75 82.6,43.1 72.75,43.1 v1(72.5,43.36) 72.36,43.5 68.5,43.5 v1(68,43)
  Inner1 w0.254: v1(28.59,27.5) 31.59,30.5 56.5,30.5 59.5,33.5 66.53,33.5 v1(67.5,32.53)
  Inner2 w0.254: v1(72,65.5) 72,57.5 v1(71.5,57)
  Bottom Layer w0.254: v1(68,43) 67.5,42.5 v1(67.5,32.53) ; v1(72.5,43.36) 72.27,43.58 72.27,56.23 v1(71.5,57) ; v1(72,65.5) 72.5,66 v1(72.5,80.5)
ASW_S1: length 166.2
  Top Layer w0.254: U5.2 83.75,43.1 82.65,42 v1(72.5,42) v1(66.5,42) ; v1(29.91,25.51) 29.86,25.46 SW2.7 29.86,9.85 28.38,8.36 22.66,8.36 20.52,10.51 20.52,12.51 21.01,13 R14.1 ; v1(74.5,32) 74.38,31.88 U4.10 v1(66.5,31.88) ; U3.10 v1(71,56.38) ; U1.10 71.62,80.38 v1(73.5,78.5) ; U2.10 72.38,64.88 v1(73,65.5)
  Inner1 w0.254: v1(29.91,25.51) 30.73,25.51 31.78,26.56 72.56,26.56 74.08,28.08 74.08,31.58 v1(74.5,32)
  Inner2 w0.254: v1(73,65.5) 73,57 72.38,56.38 v1(71,56.38)
  Bottom Layer w0.254: v1(73.5,78.5) 73.5,66 v1(73,65.5) ; v1(71,56.38) 71.92,55.46 71.92,42.25 72.17,42 v1(72.5,42) ; v1(66.5,31.88) v1(66.5,42)
ASW_S2: length 158
  Top Layer w0.254: v1(73.5,31) 73.28,31.22 U4.9 ; v1(67.5,64.5) 67.78,64.22 U2.9 ; v1(73,41) 82.16,41 84.25,43.09 U5.3 ; v1(30.67,26.95) 30.69,26.92 30.69,15.81 31.14,15.37 SW2.6 31.14,9.12 30.02,8.01 22.51,8.01 20.16,10.36 20.16,14.16 20.51,14.5 R15.1 ; U3.9 70.51,55.72 v1(70.64,55.6) ; v1(67,79) 67.72,79.72 U1.9
  Inner1 w0.254: v1(30.67,26.95) 30.7,26.92 72.42,26.92 73.5,28 v1(73.5,31)
  Inner2 w0.254: v1(70.64,55.6) 68.9,55.6 68.5,56 68.5,63.5 v1(67.5,64.5)
  Bottom Layer w0.254: v1(73.5,31) 73.5,40.5 v1(73,41) 72,41 71.56,41.44 71.56,54.68 v1(70.64,55.6) ; v1(67.5,64.5) 67,65 v1(67,79)
FIB_RX0: length 101.6
  Top Layer w0.254: v1(120,66.5) 119.68,66.83 U2.13 ; v1(138.5,34) R29.1
  Bottom Layer w0.254: v1(138.5,34) 137.92,33.42 129.58,33.42 128.86,34.14 123.85,34.14 120,38 v1(120,66.5)
FIB_RX0_CHK: length 72.8
  Top Layer w0.254: R2.2 54.5,47 v1(55.5,46) ; U5.29 95.25,51.75 v1(95.5,52)
  Inner1 w0.254: v1(95.5,52) 95.5,47.5 93,45 56.5,45 v1(55.5,46) ; 93,71 93.5,70.5 93.65,70.5 93.75,70.6 93.75,70.75 v1(93.5,71)
  Bottom Layer w0.254: v1(95.5,52) 95.5,69 v1(93.5,71)
FIB_RX0_IN: length 61.6
  Top Layer w0.254: R58.2 v1(42,79.5) ; U2.3 60.97,67.47 v1(59,65.5) ; U10.7 42.14,76.14 v1(42.5,76.5) ; v1(53,51.5) 53.75,51.5 54.5,52.25 ; 54.5,52.25 R2.1 ; 54.5,52.25 R5.1
  Bottom Layer w0.254: 51.5,65.5 43.5,65.5 42.5,66.5 v1(42.5,76.5) 42.5,79 v1(42,79.5) ; 51.5,65.5 51.08,65.08 51.08,52.42 52,51.5 v1(53,51.5) ; 51.5,65.5 v1(59,65.5)
FIB_RX1: length 73.4
  Top Layer w0.254: v1(138,38) R33.1 ; U4.13 v1(71,33.83)
  Inner1 w0.254: v1(71,33.83) 80.17,33.83 80.21,33.79 123.29,33.79 128.5,39 136.6,39 137.6,38 v1(138,38)
FIB_RX1_CHK: length 40.7
  Top Layer w0.254: v1(89.5,52.5) 89.75,52.25 U5.30 ; R1.2 59,46.57 v1(59,46.5)
  Inner1 w0.254: v1(89.5,52.5) 88,51 88,47 87.5,46.5 v1(59,46.5)
FIB_RX1_IN: length 52.1
  Top Layer w0.254: R1.1 57.07,48.93 v1(56,50) ; R1.1 R7.1 ; R1.1 57.57,49 60,49 v1(60.5,48.5) ; R70.2 v1(42,47) 42,49 v1(43,50) ; U13.7 42.14,43.64 v1(42.5,44) ; U4.3 v1(60.5,34.47)
  Inner1 w0.254: v1(43,50) v1(56,50)
  Bottom Layer w0.254: v1(60.5,34.47) v1(60.5,48.5) ; v1(42,47) 42.5,46.5 v1(42.5,44)
FIB_RX2: length 94.6
  Top Layer w0.254: U2.14 v1(120,67.47) ; v1(138.5,42) R37.1
  Inner1 w0.254: v1(120,67.47) 120.47,67 v1(136,67)
  Bottom Layer w0.254: v1(136,67) 138.58,64.42 138.58,43.76 138.5,43.67 v1(138.5,42)
FIB_RX3: length 82.8
  Top Layer w0.254: R43.1 138.5,46 v1(138,46.5) 137.5,47 v1(127.5,47) ; U4.14 71.97,34.47 v1(72,34.5)
  Inner1 w0.254: v1(72,34.5) 80,34.5 80.35,34.14 123.14,34.14 124.5,35.5 v1(124.5,36)
  Bottom Layer w0.254: v1(127.5,47) 125.5,47 124.5,46 v1(124.5,36)
FIB_RX4: length 96.3
  Top Layer w0.254: v1(131.5,34) R32.2 ; v1(121,68) 120.88,68.12 U2.15
  Bottom Layer w0.254: v1(131.5,34) 131,34.5 124,34.5 121,37.5 v1(121,68)
FIB_RX5: length 66.9
  Top Layer w0.254: R36.2 124,38 v1(123.5,37.5) ; U4.15 v1(71,35.12)
  Inner1 w0.254: v1(123.5,37.5) 123.5,36 122,34.5 80.5,34.5 79.88,35.12 v1(71,35.12)
FIB_RX6: length 87.3
  Top Layer w0.254: v1(130,42) R40.2 ; U2.12 116.82,66.17 v1(117,66)
  Inner1 w0.254: v1(129.5,64.5) 118.5,64.5 v1(117,66)
  Bottom Layer w0.254: v1(129.5,64.5) 129.5,55.45 129.58,55.37 129.58,54.88 129.5,54.8 129.5,42.5 v1(130,42)
FIB_RX7: length 74.6
  Top Layer w0.254: R44.2 128.5,46 v1(128,45.5) ; U4.12 v1(72,33.17)
  Inner1 w0.254: v1(127.5,36.5) 126.51,36.5 123.44,33.43 80.06,33.43 79.8,33.17 v1(72,33.17)
  Bottom Layer w0.254: v1(127.5,36.5) 127.5,45 v1(128,45.5)
FIB_RX_0: length 14.5
  Top Layer w0.254: CON1.C16 154.5,33.75 153.75,33 144,33 143,34 R29.2
FIB_RX_1: length 14.4
  Top Layer w0.254: R33.2 142,38 143,37 153.5,37 CON1.C18
FIB_RX_2: length 14.4
  Top Layer w0.254: R37.2 142.5,42 143.5,41 153.5,41 CON1.C20
FIB_RX_3: length 14.4
  Top Layer w0.254: R43.2 142.5,46 143.5,45 153.5,45 CON1.C22
FIB_RX_4: length 18.9
  Top Layer w0.254: R32.1 v1(136.5,34)
  Inner1 w0.254: CON1.D16 151.5,33 137.5,33 v1(136.5,34)
FIB_RX_5: length 18.9
  Top Layer w0.254: R36.1 v1(136.5,38)
  Inner1 w0.254: CON1.D18 151.5,37 137.5,37 v1(136.5,38)
FIB_RX_6: length 18.9
  Top Layer w0.254: R40.1 v1(136.5,42)
  Inner1 w0.254: CON1.D20 151.5,41 137.5,41 v1(136.5,42)
FIB_RX_7: length 18.9
  Top Layer w0.254: R44.1 v1(136.5,46)
  Inner1 w0.254: v1(136.5,46) 137.5,45 151.5,45 CON1.D22
FIB_TX0: length 119.2
  Top Layer w0.254: U1.13 111.49,82.33 v1(114.06,79.76) ; R28.1 139,30.93 v1(139,30) 130.5,30 129.36,31.14 119.35,31.14 v1(115.16,35.33)
  Bottom Layer w0.254: v1(114.06,79.76) 114.73,79.08 114.73,35.76 v1(115.16,35.33)
FIB_TX0_CHK: length 49.5
  Top Layer w0.254: R8.2 56,70 58,72 81,72 v1(82,71) ; U5.50 v1(83,52.75)
  Bottom Layer w0.254: v1(83,52.75) 83,54.5 82,55.5 v1(82,71)
FIB_TX0_OUT: length 58.4
  Top Layer w0.254: R57.1 46.5,81.5 v1(46,81) ; v1(46,46) 47,47 R69.1 ; SW1.8 53.09,65.59 53.5,66 R6.1 53.43,67 v1(52,67) ; SW1.8 v1(50.19,64.31) ; SW1.8 SW1.7 ; v1(46.5,76.82) 45.81,76.14 U9.2 ; U12.2 v1(46.5,43.64)
  Bottom Layer w0.254: v1(46.5,43.64) 46.5,45.5 v1(46,46) 46,49 49.68,52.68 49.68,63.68 50.19,64.19 v1(50.19,64.31) ; v1(46,81) 46,77.32 v1(46.5,76.82) 46,76.32 46,68.5 47.5,67 v1(52,67)
FIB_TX0_SEL: length 2.8
  Top Layer w0.254: R3.2 53,56.59 SW1.1
FIB_TX1: length 101.9
  Top Layer w0.254: U3.13 71.33,58.33 72.71,59.7 72.71,62.72 74.5,64.5 112.5,64.5 v1(113.5,63.5) ; v1(138,36) R31.1
  Inner1 w0.254: v1(132,63) 114,63 v1(113.5,63.5)
  Bottom Layer w0.254: v1(138,36) 137.18,36.82 132.68,36.82 132.5,37 132.5,62.5 v1(132,63)
FIB_TX1_CHK: length 48.9
  Top Layer w0.254: v1(54.5,70.5) 53.5,69.5 R6.2 ; U5.51 v1(80,52.25)
  Inner1 w0.254: v1(54.5,70.5) 55,71 v1(80,71)
  Bottom Layer w0.254: v1(80,52.25) v1(80,71)
FIB_TX1_OUT: length 4.2
  Top Layer w0.254: R8.1 56,66 55.64,65.64 SW1.6 SW1.5
FIB_TX1_SEL: length 2.9
  Top Layer w0.254: R4.2 56,55 55.64,55.36 SW1.3
FIB_TX2: length 112.7
  Top Layer w0.254: v1(138,40) R35.1 ; v1(116,80) 115,80 112.03,82.97 U1.14
  Inner1 w0.254: v1(115.98,40.52) 116.5,40 135,40 135.64,40.64 136.86,40.64 137.5,40 v1(138,40)
  Bottom Layer w0.254: v1(115.98,40.52) 115.45,41.05 115.45,79.45 v1(116,80)
FIB_TX3: length 94.4
  Top Layer w0.254: v1(138,44) R39.1 ; v1(116.5,64) 115.5,65 74.49,65 72.36,62.86 72.36,59.85 71.48,58.97 U3.14
  Inner1 w0.254: v1(133.5,54) 133,54.5 119,54.5 v1(118.5,54)
  Bottom Layer w0.254: v1(118.5,54) 117.5,54 116.5,55 v1(116.5,64) ; v1(138,44) 137,45 134,45 133.5,45.5 v1(133.5,54)
FIB_TX4: length 111.9
  Top Layer w0.254: v1(115,81) 112.38,83.62 U1.15 ; v1(115.68,36.32) 120.5,31.5 v1(130.5,31.5) 131,32 R30.2
  Bottom Layer w0.254: v1(115,81) 115.09,80.91 115.09,36.91 v1(115.68,36.32)
FIB_TX5: length 96.1
  Top Layer w0.254: v1(117.5,64) 116,65.5 74.49,65.5 72,63.01 72,60 71.62,59.62 U3.15 ; v1(130.5,36) R34.2
  Inner1 w0.254: v1(129,55.12) 128.88,55 v1(118,55)
  Bottom Layer w0.254: v1(118,55) 117.5,55.5 v1(117.5,64) ; v1(129,55.12) 129,37.5 v1(130.5,36)
FIB_TX6: length 103.8
  Top Layer w0.254: v1(131,41) 132.57,41 R38.2 ; v1(116.29,78.79) 113.71,78.79 110.82,81.67 U1.12
  Inner1 w0.254: v1(131,41) 130.82,40.82 117.18,40.82 v1(116.63,41.37)
  Bottom Layer w0.254: v1(116.29,78.79) 115.8,78.3 115.8,42.2 v1(116.63,41.37)
FIB_TX7: length 86.9
  Top Layer w0.254: v1(131.5,44) R41.2 ; U3.12 71.19,57.67 73.07,59.56 73.07,62.57 74.5,64 110.5,64 112.5,62 v1(113,62)
  Inner1 w0.254: v1(113,62) 130.5,62 v1(131,61.5)
  Bottom Layer w0.254: v1(131.5,44) 131.5,52.5 131,53 v1(131,61.5)
FIB_TX_0: length 14.4
  Top Layer w0.254: R28.2 143.5,32 144.5,31 153.5,31 CON1.C15
FIB_TX_1: length 14.4
  Top Layer w0.254: CON1.C17 153.5,35 144,35 143,36 R31.2
FIB_TX_2: length 14.4
  Top Layer w0.254: CON1.C19 153.5,39 143.5,39 142.5,40 R35.2
FIB_TX_3: length 14.4
  Top Layer w0.254: R39.2 142.5,44 143.5,43 153.5,43 CON1.C21
FIB_TX_4: length 18.9
  Top Layer w0.254: R30.1 v1(136.5,32)
  Inner1 w0.254: CON1.D15 151.5,31 137.5,31 v1(136.5,32)
FIB_TX_5: length 18.9
  Top Layer w0.254: R34.1 v1(136.5,36)
  Inner1 w0.254: CON1.D17 151.5,35 137.5,35 v1(136.5,36)
FIB_TX_6: length 18.9
  Top Layer w0.254: R38.1 v1(136.5,40)
  Inner1 w0.254: CON1.D19 151.5,39 137.5,39 v1(136.5,40)
FIB_TX_7: length 18.9
  Top Layer w0.254: R41.1 v1(136.5,44)
  Inner1 w0.254: v1(136.5,44) 137.5,43 151.5,43 CON1.D21
LED_B: length 93
  Top Layer w0.254: v1(18,28.5) 19,29.5 75.5,29.5 v1(76,30) ; R25.2 13,18.57 13,20 v1(17.5,24.5) ; U5.62 78.2,46.75 v1(77.26,45.81)
  Bottom Layer w0.254: v1(76,30) 77.26,31.26 v1(77.26,45.81) ; v1(17.5,24.5) 17.5,28 v1(18,28.5)
LED_G: length 89.7
  Top Layer w0.254: U5.63 79.74,46.25 79.74,46.25 79.26,46.25 79.26,46.25 78.87,46.25 v1(78.43,45.81) ; R24.2 20.72,28.79 76.29,28.79 76.43,28.93 77.43,28.93 78.43,29.93 v1(78.43,32)
  Bottom Layer w0.254: v1(78.43,45.81) v1(78.43,32)
LED_R: length 87.2
  Top Layer w0.254: v1(79.5,45.67) 79.58,45.75 U5.64 ; v1(77.5,30) 76.83,30 75.97,29.14 20.14,29.14 13.5,22.5 R23.2
  Bottom Layer w0.254: v1(79.5,45.67) 79.5,32 v1(77.5,30)
MCLR: length 63.8
  Top Layer w0.254: v1(84.56,31.02) 84.56,26.56 82,24 v1(58.5,24) ; v1(86.48,41.41) 86.25,41.64 U5.7 ; v1(57.57,15.51) R11.2 56.54,12.97 56.54,8.46 CN1.5
  Bottom Layer w0.254: v1(86.48,41.41) 84.56,39.49 v1(84.56,31.02) ; v1(57.57,15.51) 57.57,23.07 v1(58.5,24)
PGC: length 66
  Top Layer w0.254: v1(96.5,43.5) 96,43.5 93.75,45.75 U5.17
  Inner1 w0.254: CN1.1 67.5,7 69,8.5 69,10.5 74.5,16 v1(93.5,16)
  Bottom Layer w0.254: v1(93.5,16) 94.08,16.58 94.08,29.58 96.5,32 v1(96.5,43.5)
PGD: length 65.9
  Top Layer w0.254: U5.18 94.25,46.25 v1(95.5,45)
  Inner1 w0.254: v1(93.42,17.5) 92.27,16.36 74.35,16.36 68.5,10.5 67.64,10.5 64.14,7 CN1.2
  Bottom Layer w0.254: v1(93.42,17.5) 93.42,29.42 95.92,31.92 95.92,44.58 v1(95.5,45)
POW_5V: length 46.2
  Top Layer w0.254: CON1.E10 149.48,20.98 145.61,20.98 ; 145.61,21.82 145.61,22.02 146.61,23.02 149.52,23.02 CON1.E11 ; 145.61,19.01 149.51,19.01 CON1.E9
  Top Layer w0.508: F2.2 145.43,22 145.61,21.82 145.61,19.01
  Bottom Layer w0.406: CON1.E10 CON1.D10 CON1.C10 CON1.B10 CON1.A10 ; CON1.E9 CON1.D9 CON1.C9 CON1.B9 CON1.A9 ; CON1.E11 CON1.D11 CON1.C11 CON1.B11 CON1.A11
POW_12V: length 52.5
  Top Layer w0.254: CON1.B3 CON1.B2 CON1.B1 ; CON1.E1 CON1.E2 CON1.E3 ; 152.62,1.64 152.62,1.5 ; CON1.A1 CON1.A2 CON1.A3 ; CON1.C3 CON1.C2 CON1.C1 ; 152.62,3.88 CON1.D1 CON1.D2 CON1.D3 ; 150.5,1.65 150.5,1.64
  Top Layer w0.508: CON1.A1 158.5,3.02 157.12,1.64 156.36,1.64 ; F1.2 145.1,8 145.11,8.01 145.62,8.01 145.98,7.65 145.98,2 146.34,1.64 152.62,1.64 ; 152.62,1.64 154.5,1.64 ; 152.62,1.64 152.43,1.83 152.43,3.7 152.62,3.88 ; 154.5,1.64 CON1.C1 ; 154.5,1.64 156.36,1.64 ; 156.36,1.64 156.5,1.78 CON1.B1 ; CON1.E1 150.5,1.65
RS485_BUS_N: length 13.3
  Top Layer w0.152: R51.2 138.78,87.15 149.65,87.15 CON2.E18
RS485_BUS_P: length 13.3
  Top Layer w0.152: R50.2 138.78,86.85 149.65,86.85 CON2.E17
RS485_DE: length 79.7
  Top Layer w0.254: U5.59 83.35,48.25 v1(84.06,47.54) ; U6.2 U6.3 120.93,77.36 R18.1 118.96,76.93 v1(118.59,76.56) ; v1(83.56,75.76) v1(110.08,75.76)
  Inner1 w0.254: v1(118.59,76.56) 117.79,75.76 v1(110.08,75.76)
  Bottom Layer w0.254: v1(83.56,75.76) 82.99,75.76 78.71,71.48 78.71,48.89 80.06,47.54 v1(84.06,47.54)
RS485_DI: length 74
  Top Layer w0.254: v1(79,47.5) 79.25,47.25 U5.61 ; v1(81,74.59) 81.09,74.5 121.7,74.5 U6.4
  Bottom Layer w0.254: v1(79,47.5) 78.36,48.14 78.36,71.95 v1(81,74.59)
RS485_RO: length 78.4
  Top Layer w0.254: v1(78,47.5) 79,48.5 79.85,48.5 80.6,47.75 U5.60 ; v1(79,75) 79.18,75.18 113.71,75.18 118.43,79.91 U6.1
  Bottom Layer w0.254: v1(78,47.5) 78,72.56 78.06,72.62 78.06,74.06 v1(79,75)
RS485_S0_N: length 22.5
  Top Layer w0.152: R51.1 137.07,87.26 136.96,87.15 135.19,87.15 134.8,86.76 134.8,83.87 135.5,83.17 136.69,83.17 137.21,82.65 137.21,78.26 137.1,78.15 136.2,78.15 135.92,78.43 R19.1
  Top Layer w0.254: U6.7 133.07,78.64 R17.1 134.87,79.07 R19.1
RS485_S0_P: length 22.4
  Top Layer w0.152: R19.2 135.92,77.57 136.2,77.85 137.23,77.85 137.52,78.13 137.52,82.78 136.82,83.48 135.69,83.48 135.1,84.06 135.1,86.57 135.38,86.85 136.96,86.85 137.07,86.74 R50.1
  Top Layer w0.254: U6.6 133.07,77.36 R21.2 134.87,76.93 R19.2
SLOT_SW0: length 15.4
  Top Layer w0.254: CON2.D22 151.5,95 143,95 142,96 R48.1
SLOT_SW1: length 15.4
  Top Layer w0.254: CON2.D21 151.5,93 143.5,93 142.5,94 R46.1
SLOT_SW2: length 15.4
  Top Layer w0.254: CON2.D20 151.5,91 144.5,91 143.5,92 R45.1
SLOT_SW3: length 15.4
  Top Layer w0.254: R42.1 145.5,90 146.5,89 151.5,89 CON2.D19
SLOTSW_S0: length 89
  Top Layer w0.254: U5.39 87.75,57.33 v1(87.92,57.5) ; R48.2 133.42,92.35 90.64,92.35 v1(90,93)
  Bottom Layer w0.254: v1(87.92,57.5) 87.92,57.91 91.5,61.5 91.5,91 90.58,91.92 90.58,92.24 90,92.83 v1(90,93)
SLOTSW_S1: length 87.1
  Top Layer w0.254: U5.40 87.25,56.75 87,57 v1(87,57.5) ; v1(90,92) 135.07,92 R46.2
  Bottom Layer w0.254: v1(87,57.5) 91.14,61.64 91.14,90.85 v1(90,92)
SLOTSW_S2: length 86.2
  Top Layer w0.254: R45.2 136.71,91.64 90.64,91.64 v1(90,91) ; U5.42 86.25,58.25 v1(86.5,58.5)
  Bottom Layer w0.254: v1(90,91) 90.79,90.21 90.79,61.79 87.5,58.5 v1(86.5,58.5)
SLOTSW_S3: length 86.4
  Top Layer w0.254: R42.2 135.78,91.29 91.29,91.29 v1(90,90) ; v1(86,59.5) 86,58.83 85.75,58.58 U5.43
  Bottom Layer w0.254: v1(90,90) 90.43,89.57 90.43,61.94 87.99,59.5 v1(86,59.5)
SWS4: length 74.4
  Top Layer w0.254: SW3.8 40.09,26.59 41.5,28 v1(80,28) ; v1(80.5,39.5) 83,39.5 85.25,41.75 U5.5
  Bottom Layer w0.254: v1(80.5,39.5) 80.5,28.5 v1(80,28)
SWS5: length 73.3
  Top Layer w0.254: SW3.7 41.36,26.37 42,27 v1(80,27) ; v1(81.5,38.5) 82.77,38.5 85.75,41.48 U5.6
  Bottom Layer w0.254: v1(81.5,38.5) 81.5,28 80.5,27 v1(80,27)
SWS6: length 72.2
  Top Layer w0.254: U5.8 86.75,42.67 86.77,42.65 86.77,42.58 87.07,42.28 87.07,41 86.89,40.82 85.82,40.82 v1(82.5,37.5) ; SW3.6 42.64,24.63 44,26 v1(80.5,26)
  Bottom Layer w0.254: v1(80.5,26) 82.5,28 v1(82.5,37.5)
SWS7: length 74.1
  Top Layer w0.254: v1(81,25) 45,25 43.91,23.91 SW3.5 ; v1(83.5,37) 83.5,37.5 84.5,38.5 88.5,38.5 89,39 89,40.5 88.36,41.14 88.36,41.15 88.25,41.25 U5.11
  Bottom Layer w0.254: v1(83.5,37) 83.5,31.29 83.48,31.27 83.48,30.78 83.5,30.76 83.5,27.5 v1(81,25)
TP1: length 15.8
  Top Layer w0.254: U5.31 96.25,52.75 97.5,54 97.5,56 97.68,56.18 101.18,56.18 103,58 TP1.1
TP2: length 12.4
  Top Layer w0.254: TP2.1 100,58.5 98.68,57.18 95.68,57.18 95.5,57 95.5,54.75 94,53.25 U5.32
TP3: length 10.6
  Top Layer w0.254: U5.33 92.05,55.05 92.5,55.5 92.5,58 92.68,58.18 96.18,58.18 97.5,59.5 TP3.1
TP4: length 8.2
  Top Layer w0.254: U5.34 90.25,58.25 91.5,59.5 92,59.5 92.5,60 TP4.1
$1N8234: length 41.3
  Top Layer w0.254: R3.1 52.93,53 v1(52,53) ; U1.3 63.69,83 v1(61.5,83)
  Bottom Layer w0.254: v1(61.5,83) 60,81.5 60,61.5 59.18,60.68 52.18,60.68 52,60.5 v1(52,53)
$1N8273: length 15.3
  Top Layer w0.254: U3.3 60.47,58.97 59.47,57.97 59.47,54.47 v1(59,54) ; R4.1 v1(56,52)
  Bottom Layer w0.254: v1(56,52) 56.5,51.5 58.5,51.5 59,52 v1(59,54)
$1N8683: length 2.8
  Top Layer w0.254: SW1.2 54.36,54.07 R5.2
$1N8687: length 3
  Top Layer w0.254: R7.2 57.5,54.91 56.91,55.5 SW1.4
$2N4157: length 5.3
  Top Layer w0.254: R23.1 9.55,22.5 9,21.95 LED1.1
$2N4158: length 5.3
  Top Layer w0.254: LED1.3 8.85,19.35 9.5,20 R24.1
$2N4159: length 5.3
  Top Layer w0.254: LED1.4 9,18.05 9.55,17.5 R25.1
$2N4826: length 5.2
  Top Layer w0.254: U5.56 79.75,49.75 79.18,50.32 79.18,50.82 79,51 C9.2
$2N7069: length 7.5
  Top Layer w0.254: R12.2 C7.1 61.59,13.05 61.05,12.51 59.04,12.51 58.43,13.12 R11.1
$3N8331: length 3.7
  Top Layer w0.508: L1.1 103.53,18.18 U7.3
$3N10229: length 5.5
  Top Layer w0.254: U7.7 112.76,18.82 R27.1 R26.2
$4N1825: length 65.4
  Top Layer w0.254: R56.1 50.34,76.07 U9.7 v1(47,76.14) ; R54.1 v1(33.5,85) 33.5,84 32.5,83 22.75,83 U8.8 ; R61.2 v1(33.5,67)
  Inner1 w0.254: v1(33.5,85) 33.5,77 35,75.5 46.36,75.5 v1(47,76.14)
  Bottom Layer w0.254: v1(33.5,67) 29.46,71.04 29.46,80.96 v1(33.5,85)
$4N1834: length 66.9
  Top Layer w0.254: U8.7 31.38,81.38 35,85 v1(36,85) R55.1 ; v1(48.5,77.41) U9.8 50.37,77.5 52.43,77.5 R56.2 ; R62.2 v1(36,67)
  Inner1 w0.254: v1(48.5,77.41) 37.09,77.41 36,78.5 v1(36,85)
  Bottom Layer w0.254: v1(36,67) 34.5,67 29.81,71.69 29.81,80.31 34.5,85 v1(36,85)
$4N1844: length 53.7
  Top Layer w0.254: L3.1 37.97,84 34.5,84 29.34,78.84 U8.6 29.82,70.84 29.82,70.68 30,70.5 45.5,70.5 46.5,69.5 C33.1 46.97,68 48.5,68 49,67.5 C35.1
$4N1851: length 45
  Top Layer w0.254: U8.5 23.28,76.3 29.72,69.86 36.47,69.86 38.8,67.53 C32.1 41.97,68 43.5,68 44,67.5 ; v1(42.5,83.5) 42,84 L2.1 ; 44,67.5 v1(44,68.5) ; 44,67.5 C34.1
  Bottom Layer w0.254: v1(42.5,83.5) 44,82 v1(44,68.5)
$4N1858: length 20.5
  Top Layer w0.254: R63.2 v1(38.5,67) 36,69.5 29.5,69.5 25.24,73.76 U8.4
$4N1862: length 44.5
  Top Layer w0.254: U8.3 27.28,71.22 28.5,70 v1(28.5,67) R59.2 ; v1(27.5,77.5) 27.59,77.41 U10.1 ; R52.1 v1(28.5,85)
  Bottom Layer w0.254: v1(28.5,67) v1(28.5,85) 27.5,84 v1(27.5,77.5)
$4N1867: length 42.7
  Top Layer w0.254: v1(31,75.5) 31.64,76.14 U10.2 ; R53.1 v1(31,85) ; R60.2 v1(31,67)
  Inner1 w0.254: 31,68 30.32,68.68 U8.2 ; 31,68 v1(31,75.5) ; 31,68 v1(31,67)
  Bottom Layer w0.254: v1(31,67) 31,68.5 29.07,70.43 29.07,81.57 31,83.5 v1(31,85)
$4N1936: length 64.9
  Top Layer w0.254: U12.7 v1(48,43.64) ; R73.2 v1(33.5,34.5) ; R68.1 v1(33.5,39) ; U11.8 32.42,51.42 v1(33.5,52.5) R66.1
  Inner1 w0.254: v1(48,43.64) 46.86,42.5 39.5,42.5 33.5,48.5 v1(33.5,52.5) ; v1(33.5,39) v1(33.5,34.5)
  Bottom Layer w0.254: v1(33.5,34.5) 29.45,38.55 29.45,48.45 v1(33.5,52.5)
$4N1945: length 67.9
  Top Layer w0.254: R74.2 v1(36,34.5) ; R67.1 v1(36,52.5) 32.38,48.88 U11.7 ; U12.8 v1(48.5,44.91) ; R68.2 v1(36.5,39)
  Inner1 w0.254: v1(36,52.5) 36,47.5 38.59,44.91 v1(48.5,44.91)
  Bottom Layer w0.254: v1(36.5,39) 36.5,35 v1(36,34.5) 34.5,34.5 29.8,39.2 29.8,46.3 v1(36,52.5)
$4N1955: length 57.2
  Top Layer w0.254: 22.16,46.34 30.92,37.58 43.75,37.58 44,37.33 C41.1 44.5,35.53 44.5,36.5 45,37 49.5,37 50,36.5 C43.1 ; 22.16,46.34 30.84,46.34 37.03,52.53 L5.1 ; 22.16,46.34 U11.6
$4N1962: length 48.6
  Top Layer w0.254: L4.1 42,51.5 v1(41,50.5) ; C40.1 v1(41,37) 40.86,36.86 30.15,36.86 23.21,43.8 U11.5 ; C42.1 v1(47.5,35.5)
  Inner1 w0.254: v1(47.5,35.5) 46,37 v1(41,37)
  Bottom Layer w0.254: v1(41,37) v1(41,50.5)
$4N1969: length 21.6
  Top Layer w0.254: R75.2 v1(38.5,34.5) 38.5,36.25 38.25,36.5 30,36.5 25.24,41.26 U11.4
$4N1973: length 44.5
  Top Layer w0.254: R71.2 v1(28.5,34.5) 28.5,37.5 27.28,38.72 U11.3 ; U13.1 27.59,44.91 v1(27.5,45) ; R64.1 v1(28.5,52.5)
  Bottom Layer w0.254: v1(28.5,34.5) v1(28.5,52.5) 27.5,51.5 v1(27.5,45)
$4N1978: length 42.1
  Top Layer w0.254: R65.1 v1(31,52.5) ; v1(31,43.5) 33.59,43.5 U13.2 ; R72.2 v1(31,34.5)
  Inner1 w0.254: v1(31,34.5) v1(31,35.5) ; v1(31,35.5) v1(31,43.5) ; v1(31,35.5) 30.5,36 22,36 U11.2
  Bottom Layer w0.254: v1(31,35.5) 28.94,37.56 28.94,50.44 v1(31,52.5)

## Copper pours and planes (outline as drawn; the poured copper is in the pictures)
GND on Top Layer: -28.5,112 173.5,112 173.5,-7 -28.5,-7
GND on Bottom Layer: -32.5,115 178.5,115 178.5,-11.5 -32.5,-11.5
GND on Inner1: -38.5,120 182,120 182,-16.5 -38.5,-16.5
GND on Inner2: -43,124 187,124 187,-22 -43,-22

Small or netless copper shapes (teardrops, artwork), in the pictures only: 931 on Top Layer, 349 on Bottom Layer, 85 on Inner1, 8 on Inner2

## Text on the board
Bottom Silkscreen Layer: Made In Taiwan | JS203-39A-C01_03 FIBER
Top Silkscreen Layer: Made In Taiwan | JS203-39A-C01_03 FIBER
